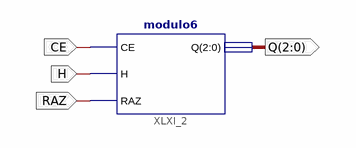
[diagram p0: schematic sheet 1]
// Xilinx ISE schematic modulo6.sch (artix7) as structural Verilog: 1 symbols, 4 ports
module modulo6 (
  input  CE,
  input  H,
  input  RAZ,
  output [2:0] Q
);

  modulo6 XLXI_2 (.CE(CE), .H(H), .Q(Q), .RAZ(RAZ));
endmodule
